# EAGLE design csa_term_v1.0a (EAGLE 4.15)
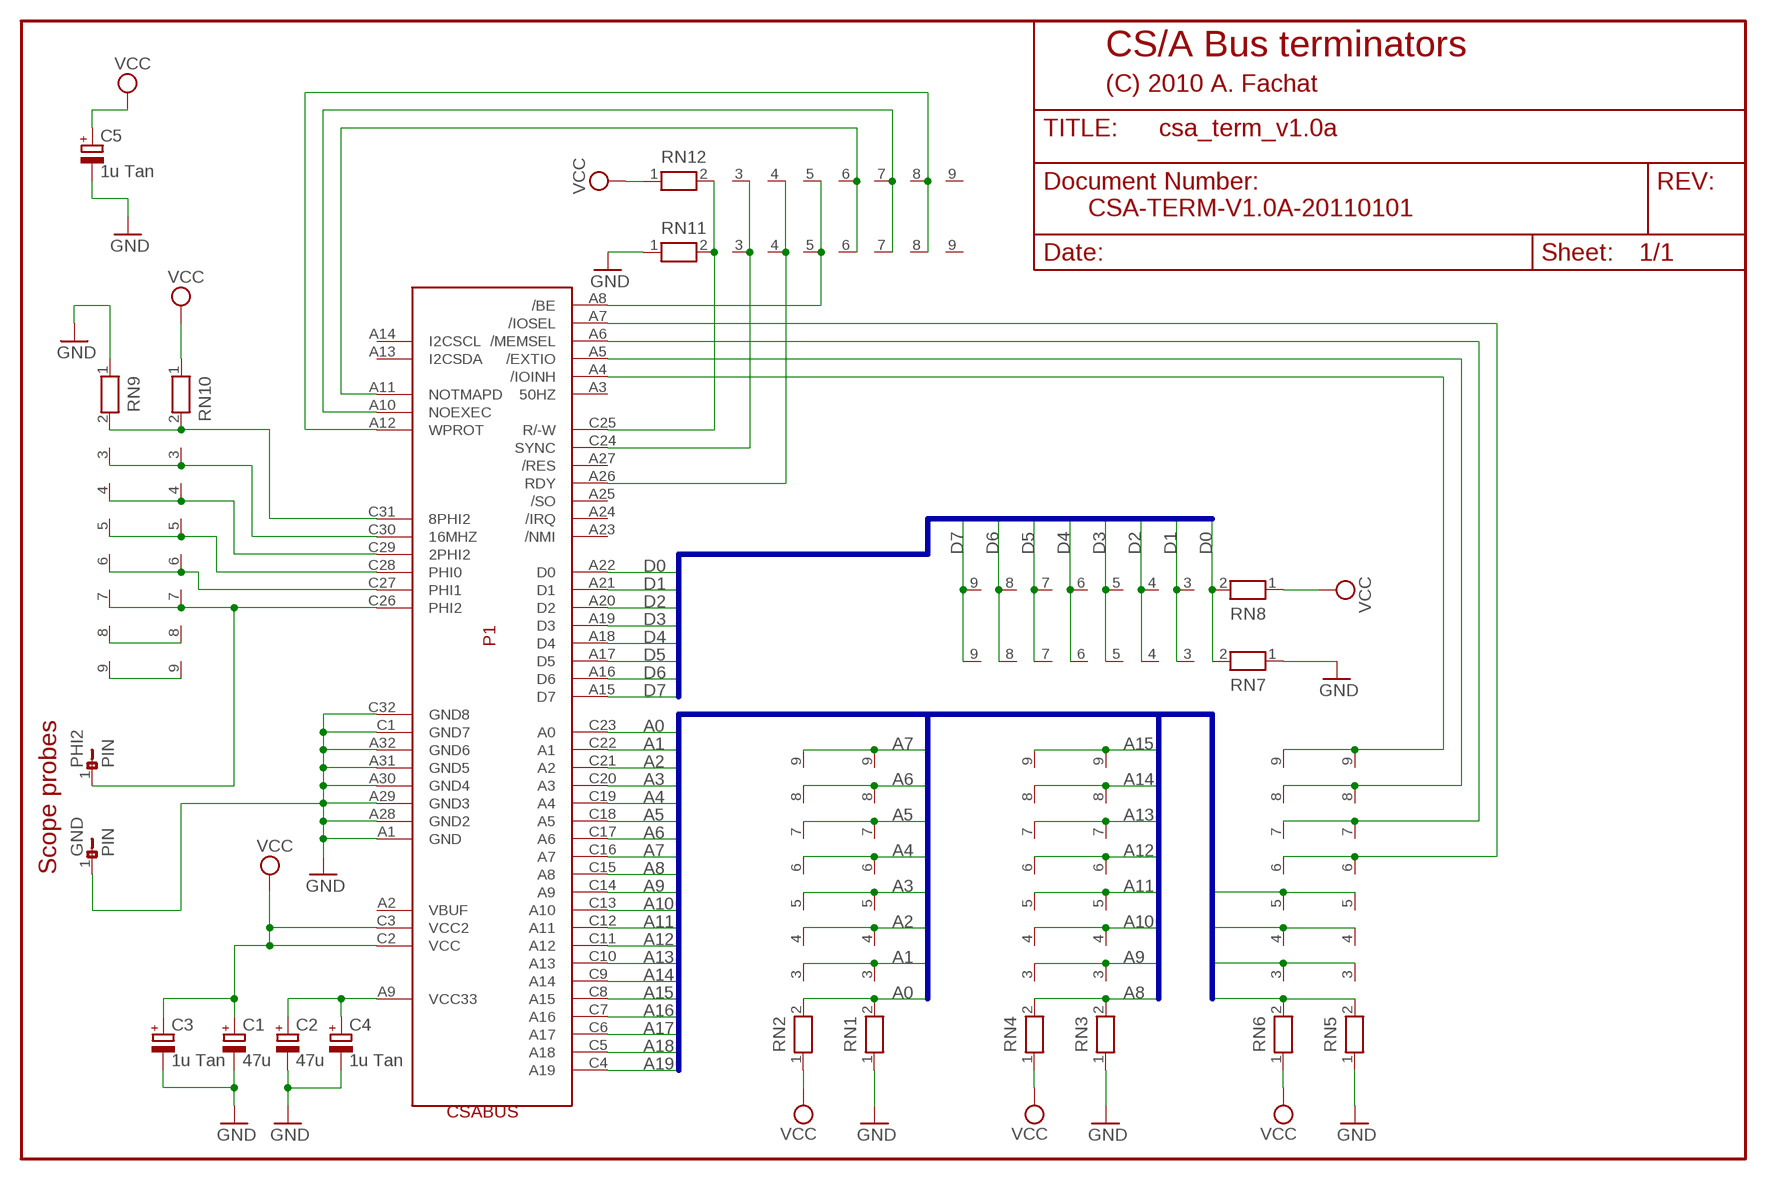
[diagram p0: schematic, sheet 1]

## Parts
C1  47u  CPOL-EUE2.5-7  [E2,5-7]
C2  47u  CPOL-EUE2.5-7  [E2,5-7]
C3  1u Tan  CPOL-EUTT2D5  [TT2D5]
C4  1u Tan  CPOL-EUTT2D5  [TT2D5]
C5  1u Tan  CPOL-EUTT2D5  [TT2D5]
GND  PIN  [PIN]
P1  CSABUS  [CSABUS]
PHI2  PIN  [PIN]
RN1  RN08  [RN-9]
RN2  RN08  [RN-9]
RN3  RN08  [RN-9]
RN4  RN08  [RN-9]
RN5  RN08  [RN-9]
RN6  RN08  [RN-9]
RN7  RN08  [RN-9]
RN8  RN08  [RN-9]
RN9  RN08  [RN-9]
RN10  RN08  [RN-9]
RN11  RN08  [RN-9]
RN12  RN08  [RN-9]

## Nets
A0: P1.C23(A0) RN1.2 RN2.2
A1: P1.C22(A1) RN1.3 RN2.3
A2: P1.C21(A2) RN1.4 RN2.4
A3: P1.C20(A3) RN1.5 RN2.5
A4: P1.C19(A4) RN1.6 RN2.6
A5: P1.C18(A5) RN1.7 RN2.7
A6: P1.C17(A6) RN1.8 RN2.8
A7: P1.C16(A7) RN1.9 RN2.9
A8: P1.C15(A8) RN3.2 RN4.2
A9: P1.C14(A9) RN3.3 RN4.3
A10: P1.C13(A10) RN3.4 RN4.4
A11: P1.C12(A11) RN3.5 RN4.5
A12: P1.C11(A12) RN3.6 RN4.6
A13: P1.C10(A13) RN3.7 RN4.7
A14: P1.C9(A14) RN3.8 RN4.8
A15: P1.C8(A15) RN3.9 RN4.9
A16: P1.C7(A16) RN5.2 RN6.2
A17: P1.C6(A17) RN5.3 RN6.3
A18: P1.C5(A18) RN5.4 RN6.4
A19: P1.C4(A19) RN5.5 RN6.5
D0: P1.A22(D0) RN7.2 RN8.2
D1: P1.A21(D1) RN7.3 RN8.3
D2: P1.A20(D2) RN7.4 RN8.4
D3: P1.A19(D3) RN7.5 RN8.5
D4: P1.A18(D4) RN7.6 RN8.6
D5: P1.A17(D5) RN7.7 RN8.7
D6: P1.A16(D6) RN7.8 RN8.8
D7: P1.A15(D7) RN7.9 RN8.9
GND: C1.- C2.- C3.- C4.- C5.- GND.1 P1.A1(GND) P1.A28(GND2) P1.A29(GND3) P1.A30(GND4) P1.A31(GND5) P1.A32(GND6) P1.C1(GND7) P1.C32(GND8) RN1.1 RN3.1 RN5.1 RN7.1 RN9.1 RN11.1
N$2: P1.A4(/IOINH) RN5.9 RN6.9
N$3: P1.A5(/EXTIO) RN5.8 RN6.8
N$4: P1.A6(/MEMSEL) RN5.7 RN6.7
N$5: P1.A7(/IOSEL) RN5.6 RN6.6
N$6: RN9.9 RN10.9
N$7: P1.C27(PHI1) RN9.6 RN10.6
N$8: P1.C28(PHI0) RN9.5 RN10.5
N$9: P1.C29(2PHI2) RN9.4 RN10.4
N$10: P1.C30(16MHZ) RN9.3 RN10.3
N$11: P1.C31(8PHI2) RN9.2 RN10.2
N$12: C2.+ C4.+ P1.A9(VCC33)
N$14: P1.A8(/BE) RN11.5 RN12.5
N$15: P1.C26(PHI2) PHI2.1 RN9.7 RN10.7
N$16: RN9.8 RN10.8
N$18: P1.A11(NOTMAPD) RN11.6 RN12.6
N$19: P1.A10(NOEXEC) RN11.7 RN12.7
N$20: P1.A12(WPROT) RN11.8 RN12.8
N$21: P1.C24(SYNC) RN11.3 RN12.3
N$22: P1.A26(RDY) RN11.4 RN12.4
N$24: P1.C25(R/-W) RN11.2 RN12.2
VCC: C1.+ C3.+ C5.+ P1.C2(VCC) P1.C3(VCC2) RN2.1 RN4.1 RN6.1 RN8.1 RN10.1 RN12.1
Unconnected: P1.A2(VBUF) P1.A3(50HZ) P1.A13(I2CSDA) P1.A14(I2CSCL) P1.A23(/NMI) P1.A24(/IRQ) P1.A25(/SO) P1.A27(/RES) RN11.9 RN12.9

## Buses
A[0..19]
D[0..7]

## Notes on the sheet
- CS/A Bus terminators
- (C) 2010 A. Fachat
- CSA-TERM-V1.0A-20110101
- Scope probes

## Library data of the parts
C1-C5 = rcl:CPOL-EU: POLARIZED CAPACITOR, European symbol
GND PHI2 = csa:PIN
P1 = csa:CSABUS
RN1-RN12 = resistor-net:RN08: RESISTOR NETWORK

## Board
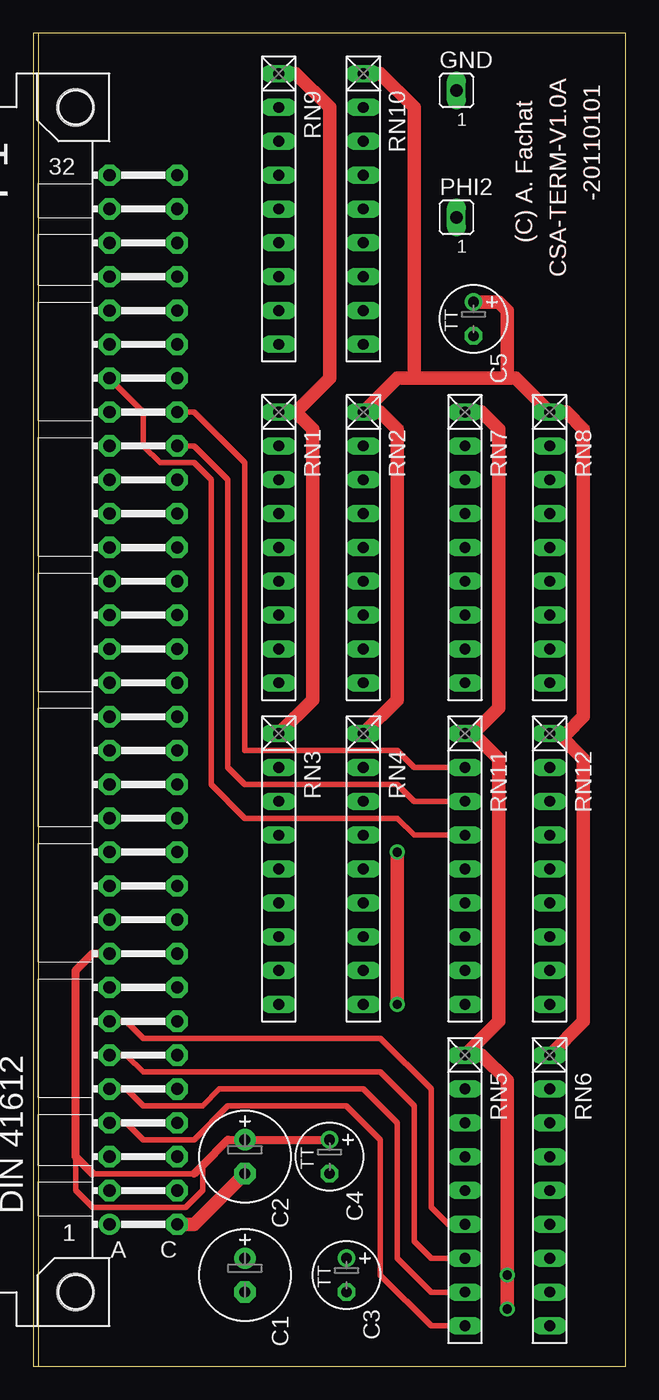
[diagram p1: board, top side]
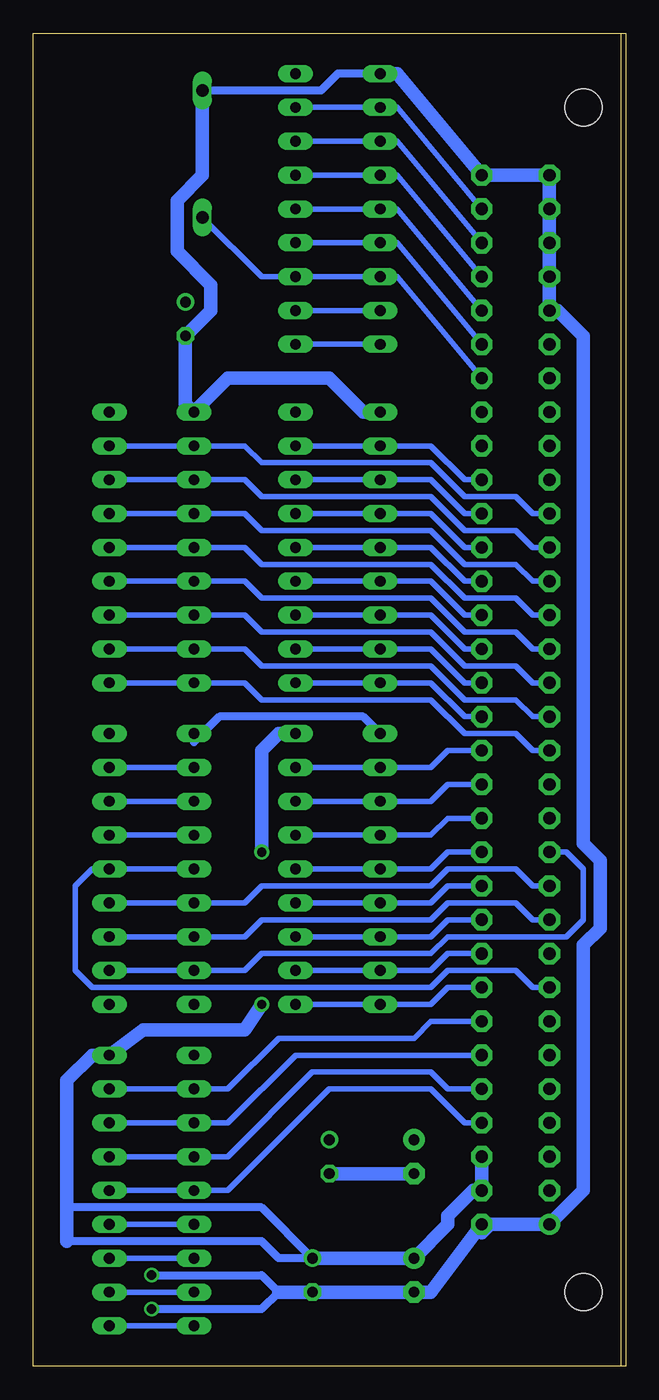
[diagram p2: board, bottom side, seen from below]

Size 44.43 x 100.03 mm. Coordinates in mm from the lower left corner, seen from the top.
Outline: 0,0.01 44.43,0.01 44.43,100.01 0,100.01 0,0.01
Copper layers (1*16): Top 0.035mm / dielectric 1.5mm / Bottom 0.035mm
Design rules "default": minimum track width 10mil, minimum drill 24mil, track to track 8mil, track to pad 8mil, pad to pad 8mil, via to via 8mil, smd to smd 8mil, copper to edge 40mil, drill to drill 8mil, minimum pad ring 10mil, minimum via ring 8mil, stop-mask expansion 4mil, vias tented up to drill 0mil, thermal gap 10mil

### Footprints (pad centres in the part's own frame; a part is rotated, then mirrored left to right if it is on the bottom)
E2,5-7 = drill 0.813 pad 1.6 round: + -1.27,0 | drill 0.813 pad 1.6 octagon: - 1.27,0
TT2D5 = drill 0.813 round: + -1.27,0 | drill 0.813 octagon: - 1.27,0
PIN = drill 0.914 long: 1 0,0
CSABUS = drill 0.914 pad 1.6 round: A1 7.62,36.83 | drill 0.914 pad 1.6 octagon: A2 7.62,34.29; A3 7.62,31.75; A4 7.62,29.21; A5 7.62,26.67; A6 7.62,24.13; A7 7.62,21.59; A8 7.62,19.05; A9 7.62,16.51; A10 7.62,13.97; A11 7.62,11.43; A12 7.62,8.89; A13 7.62,6.35; A14 7.62,3.81; A15 7.62,1.27; A16 7.62,-1.27; A17 7.62,-3.81; A18 7.62,-6.35; A19 7.62,-8.89; A20 7.62,-11.43; A21 7.62,-13.97; A22 7.62,-16.51; A23 7.62,-19.05; A24 7.62,-21.59; A25 7.62,-24.13; A26 7.62,-26.67; A27 7.62,-29.21; A28 7.62,-31.75; A29 7.62,-34.29; A30 7.62,-36.83; A31 7.62,-39.37; A32 7.62,-41.91; C1 2.54,36.83; C2 2.54,34.29; C3 2.54,31.75; C4 2.54,29.21; C5 2.54,26.67; C6 2.54,24.13; C7 2.54,21.59; C8 2.54,19.05; C9 2.54,16.51; C10 2.54,13.97; C11 2.54,11.43; C12 2.54,8.89; C13 2.54,6.35; C14 2.54,3.81; C15 2.54,1.27; C16 2.54,-1.27; C17 2.54,-3.81; C18 2.54,-6.35; C19 2.54,-8.89; C20 2.54,-11.43; C21 2.54,-13.97; C22 2.54,-16.51; C23 2.54,-19.05; C24 2.54,-21.59; C25 2.54,-24.13; C26 2.54,-26.67; C27 2.54,-29.21; C28 2.54,-31.75; C29 2.54,-34.29; C30 2.54,-36.83; C31 2.54,-39.37; C32 2.54,-41.91 | hole 2.794: 10.16,41.91; 10.16,-46.99
RN-9 = drill 0.813 long: 1 -10.16,0; 2 -7.62,0; 3 -5.08,0; 4 -2.54,0; 5 0,0; 6 2.54,0; 7 5.08,0; 8 7.62,0; 9 10.16,0

### Placement (x,y rotation side)
C1  15.87,6.83 270 top
C2  15.87,15.72 270 top
C3  23.49,6.83 270 top
C4  22.22,15.72 270 top
C5  33.02,78.59 270 top
GND  31.74,95.73 0 top
P1  13.33,47.47 180 top
PHI2  31.74,86.21 0 top
RN1  18.41,61.44 270 top
RN2  24.76,61.44 270 top
RN3  18.41,37.31 270 top
RN4  24.76,37.31 270 top
RN5  32.38,13.18 270 top
RN6  38.73,13.18 270 top
RN7  32.38,61.44 270 top
RN8  38.73,61.44 270 top
RN9  18.41,86.84 270 top
RN10  24.76,86.84 270 top
RN11  32.38,37.31 270 top
RN12  38.73,37.31 270 top

### Tracks (layer width: path | path; a pad name or v marks a point on that pad's centre or on a via)
A0
  Bottom 0.406: P1.C23 12.06,66.52 14.6,69.06 RN1.2 RN2.2
A1
  Bottom 0.406: P1.C22 12.06,63.98 14.6,66.52 RN1.3 RN2.3
A2
  Bottom 0.406: P1.C21 12.06,61.44 14.6,63.98 RN1.4 RN2.4
A3
  Bottom 0.406: P1.C20 12.06,58.9 14.6,61.44 RN1.5 RN2.5
A4
  Bottom 0.406: P1.C19 12.06,56.36 14.6,58.9 RN1.6 RN2.6
A5
  Bottom 0.406: P1.C18 12.06,53.82 14.6,56.36 RN1.7 RN2.7
A6
  Bottom 0.406: P1.C17 12.06,51.28 14.6,53.82 RN1.8 RN2.8
A7
  Bottom 0.406: P1.C16 12.06,48.74 14.6,51.28 RN1.9 RN2.9
A8
  Bottom 0.406: P1.C15 13.33,46.2 14.6,44.93 RN3.2 RN4.2
A9
  Bottom 0.406: P1.C14 13.33,43.66 14.6,42.39 RN3.3 RN4.3
A10
  Bottom 0.406: P1.C13 13.33,41.12 14.6,39.85 RN3.4 RN4.4
A11
  Bottom 0.406: P1.C12 13.33,38.58 14.6,37.31 RN3.5 RN4.5
A12
  Bottom 0.406: P1.C11 13.33,36.04 14.6,34.77 RN3.6 RN4.6
A13
  Bottom 0.406: P1.C10 13.33,33.5 14.6,32.23 RN3.7 RN4.7
A14
  Bottom 0.406: P1.C9 13.33,30.96 14.6,29.69 RN3.8 RN4.8
A15
  Bottom 0.406: P1.C8 13.33,28.42 14.6,27.15 RN3.9 RN4.9
A16
  Bottom 0.406: P1.C7 14.6,25.88 15.87,24.61 26.03,24.61 29.84,20.8 RN5.2 RN6.2
A17
  Bottom 0.406: P1.C6 24.76,23.34 29.84,18.26 RN5.3 RN6.3
A18
  Bottom 0.406: P1.C5 13.33,20.8 14.6,22.07 23.49,22.07 29.84,15.72 RN5.4 RN6.4
A19
  Bottom 0.406: P1.C4 12.06,18.26 14.6,20.8 22.22,20.8 29.84,13.18 RN5.5 RN6.5
D0
  Bottom 0.406: P1.A22 6.98,63.98 8.25,65.25 12.06,65.25 14.6,67.79 27.3,67.79 28.57,69.06 RN7.2 RN8.2
D1
  Bottom 0.406: P1.A21 6.98,61.44 8.25,62.71 12.06,62.71 14.6,65.25 27.3,65.25 28.57,66.52 RN7.3 RN8.3
D2
  Bottom 0.406: P1.A20 6.98,58.9 8.25,60.17 12.06,60.17 14.6,62.71 27.3,62.71 28.57,63.98 RN7.4 RN8.4
D3
  Bottom 0.406: P1.A19 6.98,56.36 8.25,57.63 12.06,57.63 14.6,60.17 27.3,60.17 28.57,61.44 RN7.5 RN8.5
D4
  Bottom 0.406: P1.A18 6.98,53.82 8.25,55.09 12.06,55.09 14.6,57.63 27.3,57.63 28.57,58.9 RN7.6 RN8.6
D5
  Bottom 0.406: P1.A17 6.98,51.28 8.25,52.55 12.06,52.55 14.6,55.09 27.3,55.09 28.57,56.36 RN7.7 RN8.7
D6
  Bottom 0.406: P1.A16 6.98,48.74 8.25,50.01 12.06,50.01 14.6,52.55 27.3,52.55 28.57,53.82 RN7.8 RN8.8
D7
  Bottom 0.406: P1.A15 6.98,46.2 8.25,47.47 12.06,47.47 14.6,50.01 27.3,50.01 28.57,51.28 RN7.9 RN8.9
GND  (via drill 0.7)
  Top 1.016: RN9.1 19.68,97 22.22,94.46 22.22,74.14 19.68,71.6 | 19.68,71.6 RN1.1 | 19.68,71.6 20.95,70.33 20.95,50.01 RN3.1 | 33.02,47.47 34.92,49.38 34.92,70.33 33.65,71.6 RN7.1 | 33.02,47.47 RN11.1 | 33.02,47.47 34.92,45.57 34.92,25.88 RN5.1 33.65,23.34 35.55,21.44 v35.55,6.83 v35.55,4.29 | P1.C1 12.06,10.64 C2.-
  Bottom 0.61: v35.55,6.83 27.3,6.83 26.03,5.56 27.3,4.29 v35.55,4.29 | RN3.1 19.68,48.74 30.47,48.74 32.38,46.84 | RN9.1 21.58,97 22.86,95.73 GND.1
  Bottom 1.016: RN9.1 17.14,97 P1.C32 P1.A32 P1.A31 P1.A30 P1.A29 P1.A28 5.08,79.22 3.17,77.32 3.17,39.22 1.9,37.95 1.9,32.87 3.17,31.6 3.17,13.18 P1.A1 10.16,10.64 10.79,10.01 | RN1.1 19.68,71.6 22.22,74.14 29.84,74.14 RN7.1 33.02,72.24 C5.- 31.11,79.22 31.11,81.13 33.65,83.67 33.65,87.48 31.74,89.38 GND.1 | P1.C1 14.6,5.56 C1.- C3.- 26.03,5.56 | C2.- C4.-
N$2
  Top 0.406: P1.A4 6.98,18.26 8.25,16.99 12.06,16.99 14.6,19.53 23.49,19.53 26.03,16.99 26.03,6.83 29.84,3.02 RN5.9
  Bottom 0.406: RN5.9 RN6.9
N$3
  Top 0.406: P1.A5 6.98,20.8 8.25,19.53 12.7,19.53 13.97,20.8 24.76,20.8 27.3,18.26 27.3,8.1 29.84,5.56 RN5.8
  Bottom 0.406: RN5.8 RN6.8
N$4
  Top 0.406: P1.A6 6.98,23.34 8.25,22.07 26.03,22.07 28.57,19.53 28.57,9.37 29.84,8.1 RN5.7
  Bottom 0.406: RN5.7 RN6.7
N$5
  Top 0.406: P1.A7 6.98,25.88 8.25,24.61 26.03,24.61 29.84,20.8 29.84,11.91 31.11,10.64 RN5.6
  Bottom 0.406: RN5.6 RN6.6
N$6
  Bottom 0.406: RN9.9 RN10.9
N$7
  Bottom 0.406: P1.C27 17.14,84.3 RN9.6 RN10.6
N$8
  Bottom 0.406: P1.C28 17.14,86.84 RN9.5 RN10.5
N$9
  Bottom 0.406: P1.C29 17.14,89.38 RN9.4 RN10.4
N$10
  Bottom 0.406: P1.C30 17.14,91.92 RN9.3 RN10.3
N$11
  Bottom 0.406: P1.C31 17.14,94.46 RN9.2 RN10.2
N$12
  Top 0.406: 3.17,15.72 3.17,13.18 4.44,11.91 11.43,11.91 12.7,13.18 12.7,15.09 | 4.44,14.45 12.06,14.45
  Top 0.61: P1.A9 4.44,30.96 3.17,29.69 3.17,15.72 4.44,14.45 | 12.06,14.45 12.7,15.09 14.6,16.99 C2.+ C4.+
N$14
  Bottom 0.406: P1.A8 6.98,28.42 8.25,29.69 13.33,29.69 14.6,28.42 40,28.42 41.27,29.69 41.27,36.04 40,37.31 RN12.5 RN11.5
N$15
  Bottom 0.406: P1.C26 17.14,81.76 RN9.7 RN10.7 27.3,81.76 PHI2.1
N$16
  Bottom 0.406: RN9.8 RN10.8
N$18
  Bottom 0.406: P1.A11 6.98,36.04 8.25,37.31 13.33,37.31 14.6,36.04 27.3,36.04 28.57,34.77 RN11.6 RN12.6
N$19
  Bottom 0.406: P1.A10 6.98,33.5 8.25,34.77 13.33,34.77 14.6,33.5 27.3,33.5 28.57,32.23 RN11.7 RN12.7
N$20
  Bottom 0.406: P1.A12 4.44,38.58 3.17,37.31 3.17,33.5 4.44,32.23 13.33,32.23 14.6,30.96 27.3,30.96 28.57,29.69 RN11.8 RN12.8
N$21
  Top 0.406: P1.C24 12.06,69.06 14.6,66.52 14.6,44.93 15.87,43.66 27.3,43.66 28.57,42.39 RN11.3
  Bottom 0.406: RN11.3 RN12.3
N$22
  Top 0.406: P1.A26 8.25,71.6 8.25,69.06 9.52,67.79 12.06,67.79 13.33,66.52 13.33,43.66 15.87,41.12 27.3,41.12 28.57,39.85 RN11.4
  Bottom 0.406: RN11.4 RN12.4
N$24
  Top 0.406: P1.C25 12.06,71.6 15.87,67.79 15.87,46.2 27.3,46.2 28.57,44.93 RN11.2
  Bottom 0.406: RN11.2 RN12.2
VCC  (via drill 0.7)
  Top 1.016: 28.57,74.14 27.3,74.14 RN2.1 26.03,71.6 27.3,70.33 27.3,50.01 RN4.1 | 35.55,74.14 28.57,74.14 | 35.55,74.14 36.19,74.14 RN8.1 40,71.6 41.27,70.33 41.27,48.74 40,47.47 RN12.1 39.37,47.47 41.27,45.57 41.27,25.88 RN6.1 | RN10.1 26.03,97 28.57,94.46 28.57,74.14 | v27.3,27.15 v27.3,38.58 | C5.+ 34.92,79.86 35.55,79.22 35.55,74.14
  Bottom 0.61: 41.91,11.91 27.3,11.91 C3.+ 26.03,8.1 27.3,9.37 41.91,9.37
  Bottom 1.016: RN4.1 26.03,47.47 27.3,46.2 v27.3,38.58 | v27.3,27.15 28.57,25.25 36.19,25.25 RN6.1 40,23.34 41.91,21.44 41.91,11.91 41.91,9.37 | P1.C3 P1.C2 11.43,13.18 13.33,11.28 13.33,10.64 C1.+ C3.+

### Text on the board
Top: -20110101 | (C) A. Fachat | CSA-TERM-V1.0A
tPlace: -20110101 | (C) A. Fachat | CSA-TERM-V1.0A